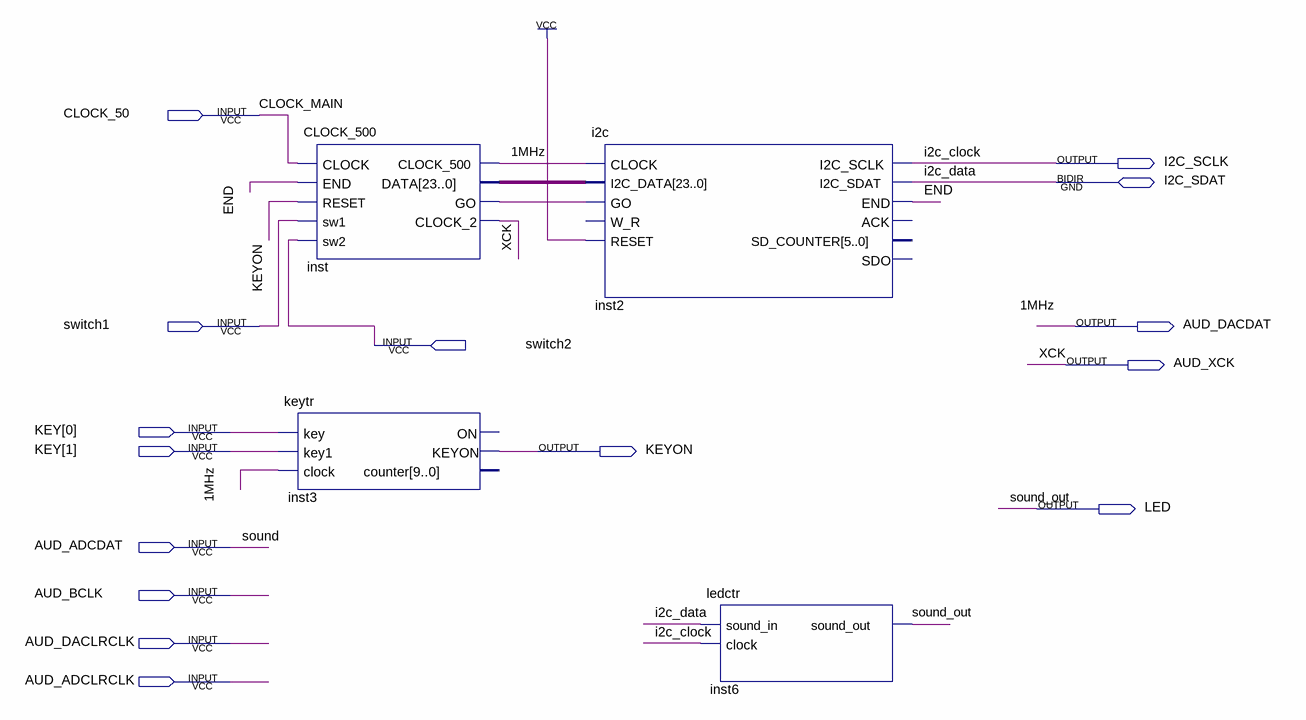
[diagram p0: schematic sheet]
// Quartus schematic AUDIO_FINAL.bdf as structural Verilog: 4 symbols, 15 pins
module AUDIO_FINAL (
  input  CLOCK_50,
  input  switch1,
  input  switch2,
  input  [1:0] KEY,
  input  AUD_ADCDAT,
  input  AUD_BCLK,
  input  AUD_DACLRCLK,
  input  AUD_ADCLRCLK,
  inout  I2C_SDAT,
  output I2C_SCLK,
  output AUD_DACDAT,
  output AUD_XCK,
  output KEYON,
  output LED
);

  wire END, inst_go;
  wire [23:0] inst_data;

  CLOCK_500 inst (
    .CLOCK(CLOCK_50), .END(END), .RESET(KEYON), .sw1(switch1), .sw2(switch2), .CLOCK_500(AUD_DACDAT),
    .DATA(inst_data), .GO(inst_go), .CLOCK_2(AUD_XCK));
  keytr inst3 (.key(KEY[0]), .key1(KEY[1]), .clock(AUD_DACDAT), .KEYON(KEYON));  // open: ON, counter
  i2c inst2 (
    .CLOCK(AUD_DACDAT), .I2C_DATA(inst_data), .GO(inst_go), .RESET(1'b1), .I2C_SCLK(I2C_SCLK), .END(END),
    .I2C_SDAT(I2C_SDAT));  // open: W_R, ACK, SD_COUNTER, SDO
  ledctr inst6 (.sound_in(I2C_SDAT), .clock(I2C_SCLK), .sound_out(LED));

  // Other names for the same wires on the sheet: 1MHz = AUD_DACDAT; CLOCK_MAIN = CLOCK_50; i2c_clock = I2C_SCLK;
  //   i2c_data = I2C_SDAT; sound = AUD_ADCDAT; sound_out = LED; XCK = AUD_XCK
endmodule
